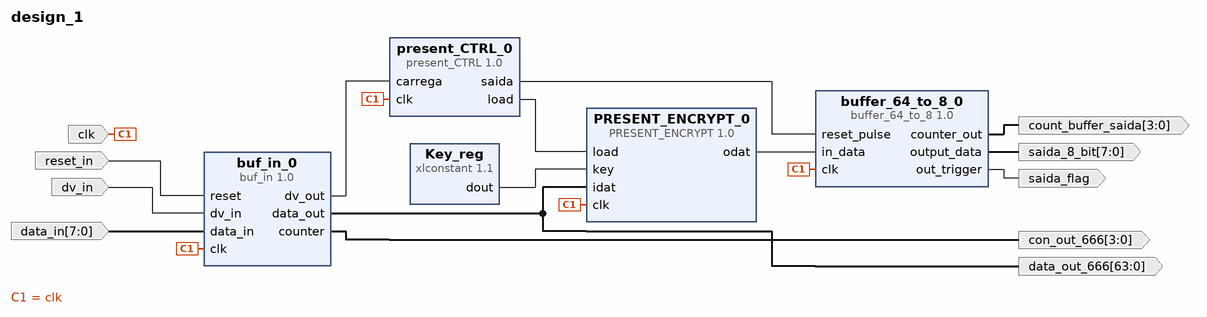
[diagram p0: block diagram of the top level]
# Vivado block design design_1, xc7a35tcpg236-1, Vivado 2018.3
create_bd_design design_1

create_bd_port -dir I -type clk clk
set_property -dict {CONFIG.FREQ_HZ 100000000} [get_bd_ports clk]
create_bd_port -dir I reset_in
create_bd_port -dir I dv_in
create_bd_port -dir I -from 7 -to 0 data_in
create_bd_port -dir O -from 3 -to 0 con_out_666
create_bd_port -dir O -from 63 -to 0 data_out_666
create_bd_port -dir O -from 7 -to 0 saida_8_bit
create_bd_port -dir O saida_flag
create_bd_port -dir O -from 3 -to 0 count_buffer_saida

create_bd_cell -type ip -vlnv xilinx.com:user:buf_in:1.0 buf_in_0
create_bd_cell -type ip -vlnv xilinx.com:user:buffer_64_to_8:1.0 buffer_64_to_8_0
create_bd_cell -type ip -vlnv xilinx.com:user:present_CTRL:1.0 present_CTRL_0
create_bd_cell -type ip -vlnv xilinx.com:user:PRESENT_ENCRYPT:1.0 PRESENT_ENCRYPT_0
create_bd_cell -type ip -vlnv xilinx.com:ip:xlconstant:1.1 Key_reg
set_property -dict {CONFIG.CONST_VAL 0 CONFIG.CONST_WIDTH 80} [get_bd_cells Key_reg]

# ---- connections ----

connect_bd_net [get_bd_pins present_CTRL_0/load] [get_bd_pins PRESENT_ENCRYPT_0/load]
connect_bd_net [get_bd_pins present_CTRL_0/saida] [get_bd_pins buffer_64_to_8_0/reset_pulse]
connect_bd_net [get_bd_pins buf_in_0/data_out] [get_bd_pins PRESENT_ENCRYPT_0/idat] [get_bd_ports data_out_666]
connect_bd_net [get_bd_ports clk] \
  [get_bd_pins buf_in_0/clk] [get_bd_pins present_CTRL_0/clk] [get_bd_pins PRESENT_ENCRYPT_0/clk] \
  [get_bd_pins buffer_64_to_8_0/clk]
connect_bd_net [get_bd_ports reset_in] [get_bd_pins buf_in_0/reset]
connect_bd_net [get_bd_ports dv_in] [get_bd_pins buf_in_0/dv_in]
connect_bd_net [get_bd_ports data_in] [get_bd_pins buf_in_0/data_in]
connect_bd_net [get_bd_pins Key_reg/dout] [get_bd_pins PRESENT_ENCRYPT_0/key]
connect_bd_net [get_bd_pins buffer_64_to_8_0/out_trigger] [get_bd_ports saida_flag]
connect_bd_net [get_bd_pins buffer_64_to_8_0/output_data] [get_bd_ports saida_8_bit]
connect_bd_net [get_bd_pins buffer_64_to_8_0/counter_out] [get_bd_ports count_buffer_saida]
connect_bd_net [get_bd_pins PRESENT_ENCRYPT_0/odat] [get_bd_pins buffer_64_to_8_0/in_data]
connect_bd_net [get_bd_pins buf_in_0/dv_out] [get_bd_pins present_CTRL_0/carrega]
connect_bd_net [get_bd_pins buf_in_0/counter] [get_bd_ports con_out_666]

validate_bd_design
save_bd_design
